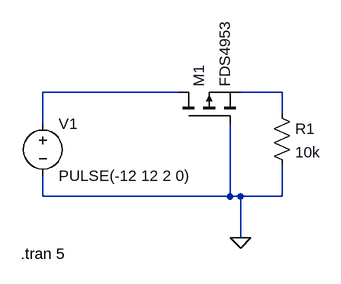
[diagram p0: schematic polarityprotection_pchannel.asc]
polarityprotection_pchannel.asc, the LTspice schematic file:
Version 4
SHEET 1 880 680
WIRE 96 48 -112 48
WIRE 256 48 192 48
WIRE 256 80 256 48
WIRE -112 96 -112 48
WIRE -112 208 -112 176
WIRE 176 208 176 96
WIRE 176 208 -112 208
WIRE 192 208 176 208
WIRE 256 208 256 160
WIRE 256 208 192 208
WIRE 192 272 192 208
FLAG 192 272 0
SYMBOL pmos 96 96 R270
SYMATTR InstName M1
SYMATTR Value FDS4953
SYMBOL voltage -112 80 R0
WINDOW 123 0 0 Left 2
WINDOW 39 0 0 Left 2
SYMATTR InstName V1
SYMATTR Value PULSE(-12 12 2 0)
SYMBOL res 240 64 R0
SYMATTR InstName R1
SYMATTR Value 10k
TEXT -146 296 Left 2 !.tran 5

The netlist it stands for:
* polarityprotection_pchannel.asc
M1 N001 0 N002 N002 FDS4953
V1 N001 0 PULSE(-12 12 2 0)
R1 N002 0 10k
.model NMOS NMOS
.model PMOS PMOS
.lib standard.mos
.tran 5
.backanno
.end